# Altium schematic sheet FRAM.SchDoc
size 420 x 297 mm; Revision: V1.2.1; SheetNumber: 10; SheetTotal: 12
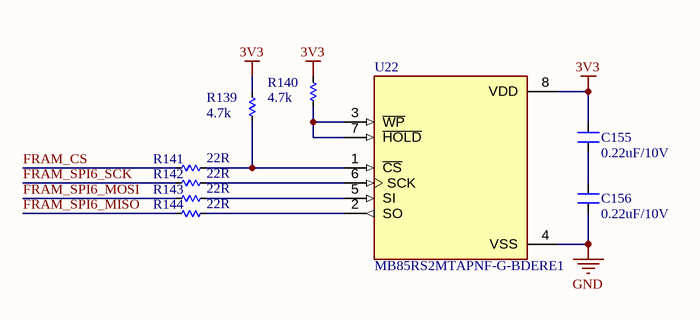
[diagram p0: FRAM.SchDoc]

## Parts
C155  0.22uF/10V  [CAP_C_1608X80]
C156  0.22uF/10V  [CAP_C_1608X80]
R139  4.7k  [RES_C_1608X60]
R140  4.7k  [RES_C_1608X60]
R141  22R  [RES_C_1608X60]
R142  22R  [RES_C_1608X60]
R143  22R  [RES_C_1608X60]
R144  22R  [RES_C_1608X60]
U22  MB85RS2MTAPNF-G-BDERE1  [MB85RS2MTAPNF-G-BDERE1]

## Nets
3V3: C155.2 R139.1 R140.1 U22.8(VDD)
GND: C156.1 U22.4(VSS)
FRAM_CS: R141.1
FRAM_SPI6_MISO: R144.1
FRAM_SPI6_MOSI: R143.1
FRAM_SPI6_SCK: R142.1
NetC155_1: C155.1 C156.2
NetR139_2: R139.2 R141.2 U22.1(~{CS})
NetR140_2: R140.2 U22.3(~{WP}) U22.7(~{HOLD})
NetR142_2: R142.2 U22.6(SCK)
NetR143_2: R143.2 U22.5(SI)
NetR144_2: R144.2 U22.2(SO)

## Notes on the sheet
- Project:
- BEE-PC1
- Sub-system:
- NANORACK_EXP_CONTROLLER
- Design by:
- SANG HUYNH
- BAO BUI Q.
- Sheet title:
- Sheet
- A3
- of
- Checked by:
- Approved by:
- VU PHAM
- Revision:
- Document No:
- Size:
- Date:

## Library data of the parts
C155 C156 = Capacitors: Value: 33pF
R139-R144 = Res SMD: SMD; Manufacturer: Generic Components; Class: Passive; Published: 08/06/2000; Publisher: Altium Hobart Technology Centre
U22 = MB85RS2MTAPNF-G-BDERE1: FRAM _Ferroelectric RAM_ Memory IC 2Mb _256K x 8_ SPI 40MHz 8-SOP; MF: Fujitsu Electronics; Package: SO-8 Fujitsu; Value: *; Digi-Key_Purchase_URL: https://www.digikey.com/product-detail/en/fujitsu-electronics-america-inc/MB85RS2MTAPNF-G-BDERE1/865-1286-1-ND/7916252?utm_source=snapeda&utm_medium=aggregator&utm_campaign=symbol; Digi-Key_Part_Number: 865-1286-1-ND; SnapEDA_Link: https://www.snapeda.com/parts/MB85RS2MTAPNF-G-BDERE1/Fujitsu%20Electronics%20America%2C%20Inc./view-part/2344795/?ref=snap; MP: MB85RS2MTAPNF-G-BDERE1